# Altium schematic sheet Microprocessor_Unit.SchDoc
size A3; DrawnBy: Hanif; Organization: AFRA Technology; DocumentNumber: 1; SheetNumber: 1; SheetTotal: 7
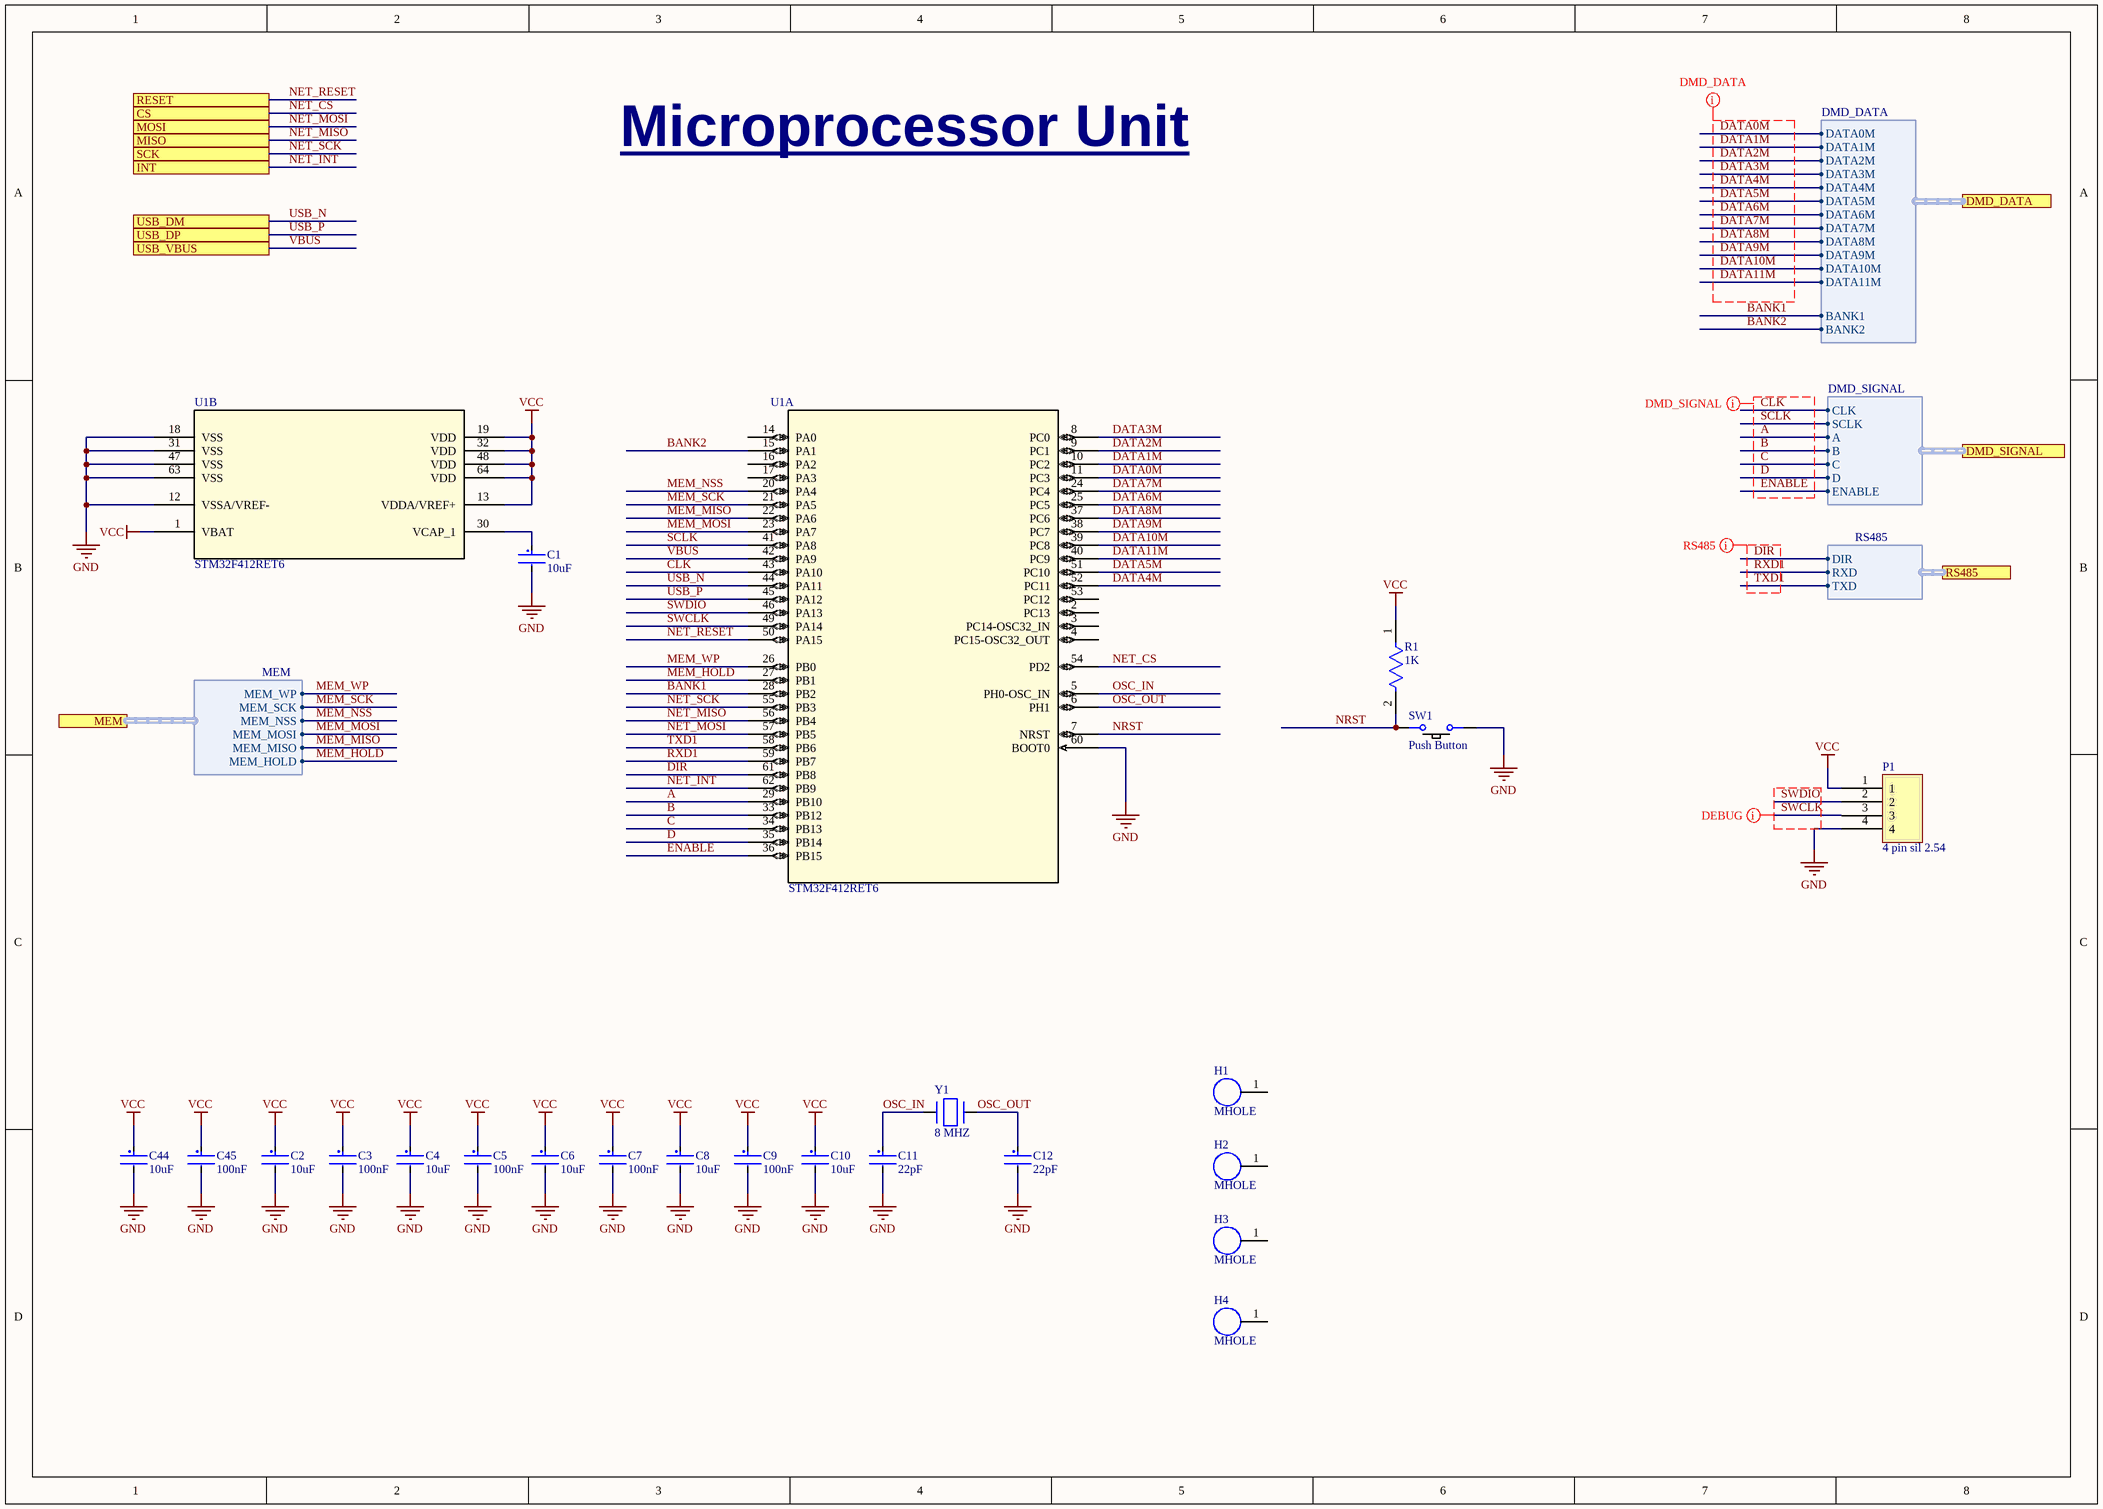
[diagram p0: Microprocessor_Unit.SchDoc]

## Parts
C1  10uF  [Samsung_CL31_IPC_A_1206]
C2  10uF  [Samsung_CL31_IPC_A_1206]
C3  100nF  [Samsung_CL31_IPC_A_1206]
C4  10uF  [Samsung_CL31_IPC_A_1206]
C5  100nF  [Samsung_CL31_IPC_A_1206]
C6  10uF  [Samsung_CL31_IPC_A_1206]
C7  100nF  [Samsung_CL31_IPC_A_1206]
C8  10uF  [Samsung_CL31_IPC_A_1206]
C9  100nF  [Samsung_CL31_IPC_A_1206]
C10  10uF  [Samsung_CL31_IPC_A_1206]
C11  22pF  [Samsung_CL31_IPC_A_1206]
C12  22pF  [Samsung_CL31_IPC_A_1206]
C44  10uF  [Samsung_CL31_IPC_A_1206]
C45  100nF  [Samsung_CL31_IPC_A_1206]
H1  MHOLE  [MHOLE]  (no BOM)
H2  MHOLE  [MHOLE]  (no BOM)
H3  MHOLE  [MHOLE]  (no BOM)
H4  MHOLE  [MHOLE]  (no BOM)
P1  4 pin sil 2.54  [4 pin sil 2.54]
R1  1K  [YAGEO_RC1206-0_65_IPC_A]
SW1  Push Button  [Tactile Switch SPST]
U1  STM32F412RET6  [LQFP64-10x10mm]  (parts A,B of 2)
Y1  8 MHZ  [CTS_ATS080B_0]

## Ports
CS, DMD_DATA (harness DMD_DATA), DMD_SIGNAL (harness DMD_SIGNAL), INT, MEM (harness MEM), MISO, MOSI, RESET, RS485 (harness RS485), SCK, USB_DM, USB_DP, USB_VBUS

## Harnesses
RS485: DIR, RXD, TXD
DMD_SIGNAL: CLK, SCLK, A, B, C, D, ENABLE
DMD_DATA: DATA0M, DATA1M, DATA2M, DATA3M, DATA4M, DATA5M, DATA6M, DATA7M, DATA8M, DATA9M, DATA10M, DATA11M, BANK1, BANK2
MEM: MEM_MISO, MEM_MOSI, MEM_NSS, MEM_SCK, MEM_WP, MEM_HOLD

## Nets
GND: C1.2 C2.2 C3.2 C4.2 C5.2 C6.2 C7.2 C8.2 C9.2 C10.2 C11.2 C12.2 C44.2 C45.2 P1.4 SW1.1,2 U1.12(VSSA/VREF-) U1.18(VSS) U1.31(VSS) U1.47(VSS) U1.60(BOOT0) U1.63(VSS)
VCC: C2.1 C3.1 C4.1 C5.1 C6.1 C7.1 C8.1 C9.1 C10.1 C44.1 C45.1 P1.1 R1.1 U1.1(VBAT) U1.13(VDDA/VREF+) U1.19(VDD) U1.32(VDD) U1.48(VDD) U1.64(VDD)
A: U1.29(PB10) ; port DMD_SIGNAL.A
B: U1.33(PB12) ; port DMD_SIGNAL.B
BANK1: U1.28(PB2) ; port DMD_DATA.BANK1
BANK2: U1.15(PA1) ; port DMD_DATA.BANK2
C: U1.34(PB13) ; port DMD_SIGNAL.C
CLK: U1.43(PA10) ; port DMD_SIGNAL.CLK
D: U1.35(PB14) ; port DMD_SIGNAL.D
DATA0M: U1.11(PC3) ; port DMD_DATA.DATA0M
DATA1M: U1.10(PC2) ; port DMD_DATA.DATA1M
DATA2M: U1.9(PC1) ; port DMD_DATA.DATA2M
DATA3M: U1.8(PC0) ; port DMD_DATA.DATA3M
DATA4M: U1.52(PC11) ; port DMD_DATA.DATA4M
DATA5M: U1.51(PC10) ; port DMD_DATA.DATA5M
DATA6M: U1.25(PC5) ; port DMD_DATA.DATA6M
DATA7M: U1.24(PC4) ; port DMD_DATA.DATA7M
DATA8M: U1.37(PC6) ; port DMD_DATA.DATA8M
DATA9M: U1.38(PC7) ; port DMD_DATA.DATA9M
DATA10M: U1.39(PC8) ; port DMD_DATA.DATA10M
DATA11M: U1.40(PC9) ; port DMD_DATA.DATA11M
DIR: U1.61(PB8) ; port RS485.DIR
ENABLE: U1.36(PB15) ; port DMD_SIGNAL.ENABLE
MEM_HOLD: U1.27(PB1) ; port MEM.MEM_HOLD
MEM_MISO: U1.22(PA6) ; port MEM.MEM_MISO
MEM_MOSI: U1.23(PA7) ; port MEM.MEM_MOSI
MEM_NSS: U1.20(PA4) ; port MEM.MEM_NSS
MEM_SCK: U1.21(PA5) ; port MEM.MEM_SCK
MEM_WP: U1.26(PB0) ; port MEM.MEM_WP
NET_CS: U1.54(PD2) ; port CS
NET_INT: U1.62(PB9) ; port INT
NET_MISO: U1.56(PB4) ; port MISO
NET_MOSI: U1.57(PB5) ; port MOSI
NET_RESET: U1.50(PA15) ; port RESET
NET_SCK: U1.55(PB3) ; port SCK
NRST: R1.2 SW1.3,4 U1.7(NRST)
OSC_IN: C11.1 U1.5(PH0-OSC_IN) Y1.1
OSC_OUT: C12.1 U1.6(PH1) Y1.2
RXD1: U1.59(PB7) ; port RS485.RXD
SCLK: U1.41(PA8) ; port DMD_SIGNAL.SCLK
SWCLK: P1.3 U1.49(PA14)
SWDIO: P1.2 U1.46(PA13)
TXD1: U1.58(PB6) ; port RS485.TXD
USB_N: U1.44(PA11) ; port USB_DM
USB_P: U1.45(PA12) ; port USB_DP
VBUS: U1.42(PA9) ; port USB_VBUS
NetC1_1: C1.1 U1.30(VCAP_1)

Not connected (* = marked no-connect by the designer): H1 1; H2 1; H3 1; H4 1; U1 2(PC13) 3(PC14-OSC32_IN) 4(PC15-OSC32_OUT) 14(PA0) 16(PA2) 17(PA3) 53(PC12)

## Layout directives
net class DMD_DATA: DATA0M, DATA1M, DATA2M, DATA3M, DATA4M, DATA5M, DATA6M, DATA7M, DATA8M, DATA9M, DATA10M, DATA11M
net class DMD_SIGNAL; rule Width Constraint [Pref Width = 20mil    Min Width = 6mil    Max Width = 20mil]: A, B, C, CLK, D, ENABLE, SCLK
net class RS485: DIR, RXD1, TXD1
net class DEBUG: SWCLK

## Notes on the sheet
- Microprocessor Unit
- Project Name:
- Size:
- Date:
- C
- Doc Num:
- Time:
- Version:
- Sheet
- of
- File:
- Drawn by:

## Library data of the parts
C1 C2 C4 C6 C8 C10 C44 = CL31A106KQHNNWE: CAP CER 10UF 6.3V X5R 1206, ±10% 6.3V Ceramic Capacitor X5R 1206 (3216 Metric); Supplier 1: Digi-Key; Supplier Part Number 1: 1276-3043-1-ND
C3 C5 C7 C9 C45 = CL31B104KBCNFNC: CAP CER 0.1UF 50V X7R 1206, ±10% 50V Ceramic Capacitor X7R 1206 (3216 Metric); Supplier 1: Digi-Key; Supplier Part Number 1: 1276-2744-1-ND
C11 C12 = CL31C220JIFNFNE: CAP CER 22PF 1KV C0G/NP0 1206, ±5% 1000V (1kV) Ceramic Capacitor C0G, NP0 1206 (3216 Metric); Supplier 1: Digi-Key; Supplier Part Number 1: 1276-3227-1-ND
R1 = RC1206JR-071KL: 1 ±5% 0.25W, 1/4W Chip Resistor 1206 (3216 Metric) Moisture Resistant Thick Film; Supplier 1: Digi-Key; Supplier Part Number 1: 311-1.0KERCT-ND
SW1 = PTS526SKG15SMTR2LFS: Switch Tactile N.O. SPST Round Button Gull Wing 0.05A 12VDC 200000Cycles 2.45N SMD T/R; Manufacturer: ITT C&K; Supplier 1: Digi-Key; Manufacturer Part Number: PTS526SKG15SMTR2LFS; RoHS: No; Category: Tactile Switches; Stock 1: 7554; Pricing 1: 1=0.13000, 10=0.12100, 25=0.11480, 100=0.10430, 250=0.09808, 500=0.08972, 1000=0.07511 (USD); Supplier Part Number 1: CKN12223-1-ND
U1 = STM32F401RCT6: No Description Available; Mfr_Name: STMicroelectronics; Copyright: Copyright (C) 2022 Ultra Librarian. All rights reserved.; Manufacturer_Part_Number: STM32F401RCT6; RefDes: RefDes; Type: DEV
Y1 = CRYSTAL 8.000MHZ: CRYSTAL 8.000MHZ 20PF THRU; Manufacturer: TXC; Manufacturer Part Number: 9B-8.000MBBK-B; Frequency Stability: 50ppm; Frequency: 8MHz; ESR (Equivalent Series Resistance): 80R; Supplier 1: Digi-Key; RoHS: Yes; Category: Crystals; Pricing 1: 1000=0.16000 (USD); Mount: Through Hole; Case/Package: Metal; Min Operating Temperature: -20°C; Max Operating Temperature: 70°C; Package Quantity: 1000; Frequency Tolerance: 50ppm; Load Capacitance: 20pF; Packaging: Bulk; Length: 0.453inch; Width: 0.197inch; Height: 0.145inch; ComponentLink1URL: https://datasheet.ciiva.com/6733/9b-6733750.pdf?src-supplier=Digi-Key; ComponentLink1Description: https://datasheet.ciiva.com/6733/9b-6733750.pdf?src-supplier=Digi-Key; ComponentLink2URL: https://datasheet.ciiva.com/29631/9b-29631174.pdf?src-supplier=Digi-Key; ComponentLink2Description: https://datasheet.ciiva.com/29631/9b-29631174.pdf?src-supplier=Digi-Key; Supplier Part Number 1: 887-2033-ND